# Altium schematic sheet AFE.SchDoc: Analog Front End
size A4; Date: 2016/01/04; Author: Samuel López; DocumentNumber: 2; SheetNumber: 2; SheetTotal: 7; Project: H2H Main Board
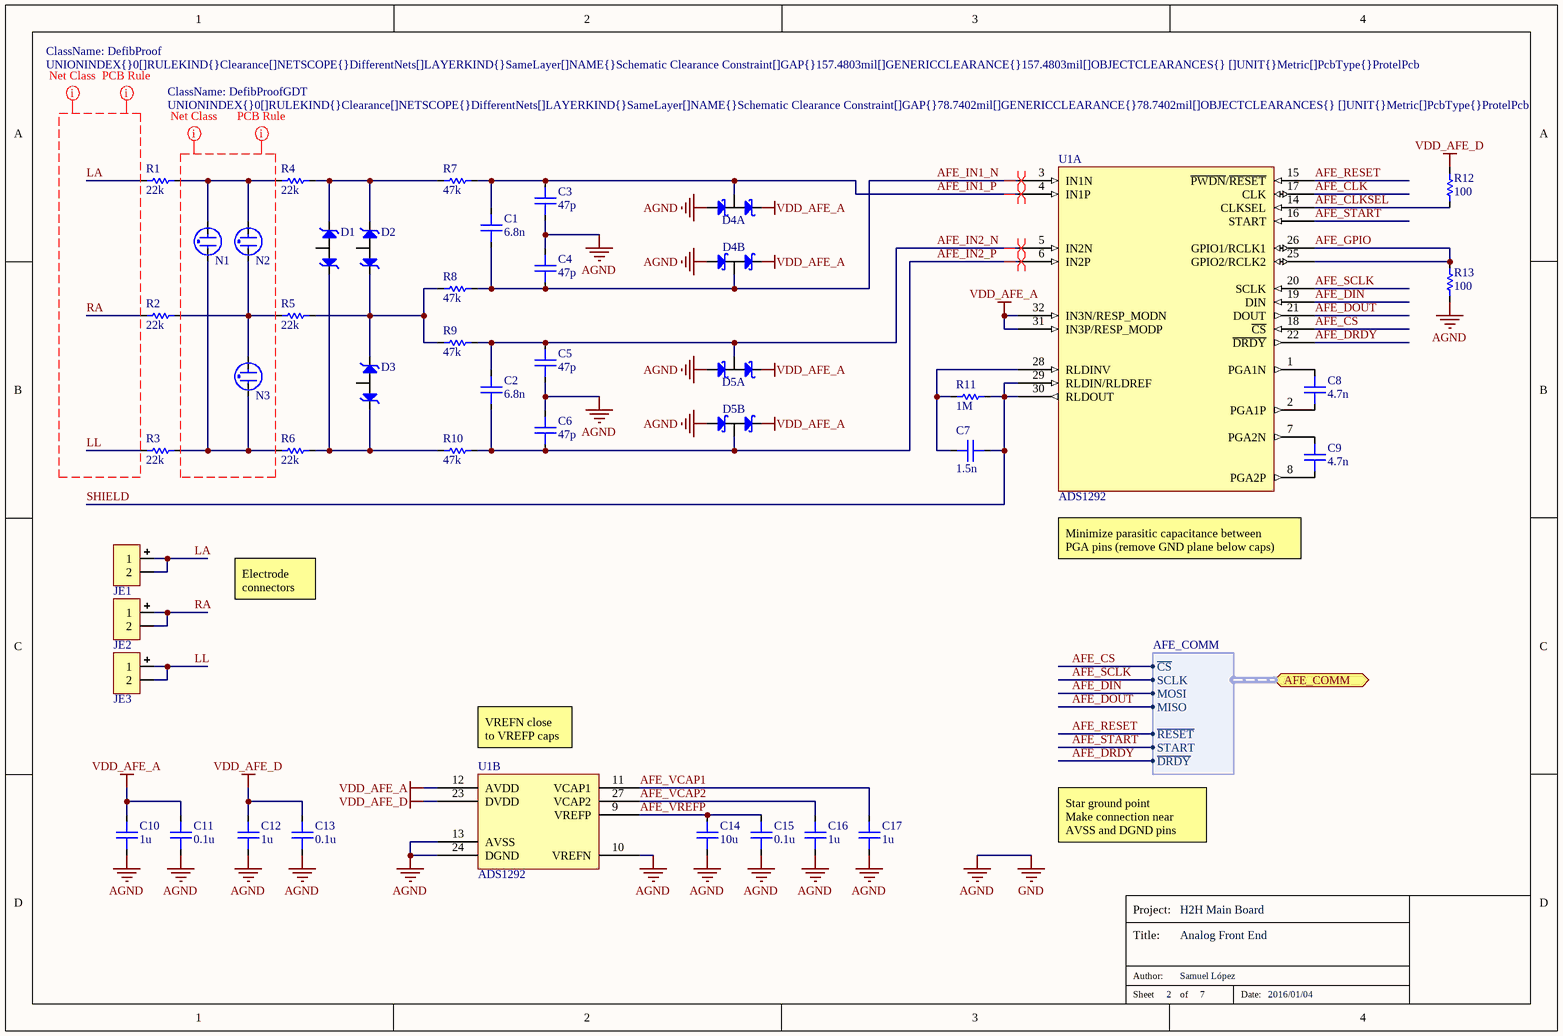
[diagram p0: AFE.SchDoc]

## Parts
C1  6.8n  [C0603]
C2  6.8n  [C0603]
C3  47p  [C0603]
C4  47p  [C0603]
C5  47p  [C0603]
C6  47p  [C0603]
C7  1.5n  [C0603]
C8  4.7n  [C0603]
C9  4.7n  [C0603]
C10  1u  [C0603]
C11  0.1u  [C0603]
C12  1u  [C0603]
C13  0.1u  [C0603]
C14  10u  [C0603]
C15  0.1u  [C0603]
C16  1u  [C0603]
C17  1u  [C0603]
D1  PESD5V0X1  [PESD5V0X1BT]  (value not drawn)
D2  PESD5V0X1  [PESD5V0X1BT]  (value not drawn)
D3  PESD5V0X1  [PESD5V0X1BT]  (value not drawn)
D4  BAS70DW-04  [BAS70DW-04]  (value not drawn)  (parts A,B of 2)
D5  BAS70DW-04  [BAS70DW-04]  (value not drawn)  (parts A,B of 2)
JE1  JST PH 2 Pin  [S2B-PH-K-S]  (value not drawn)
JE2  JST PH 2 Pin  [S2B-PH-K-S]  (value not drawn)
JE3  JST PH 2 Pin  [S2B-PH-K-S]  (value not drawn)
N1  GDT  [2051-09-SM]  (value not drawn)
N2  GDT  [2051-09-SM]  (value not drawn)
N3  GDT  [2051-09-SM]  (value not drawn)
R1  22k  [R2512]
R2  22k  [R2512]
R3  22k  [R2512]
R4  22k  [R2512]
R5  22k  [R2512]
R6  22k  [R2512]
R7  47k  [R0603]
R8  47k  [R0603]
R9  47k  [R0603]
R10  47k  [R0603]
R11  1M  [R0603]
R12  100  [R0603]
R13  100  [R0603]
U1  ADS1292  [ADS129x]  (parts A,B of 2)

## Ports
AFE_COMM (harness AFE_COMM)

## Harnesses
AFE_COMM: SCLK, MOSI, MISO, ~{CS}, ~{RESET}, START, ~{DRDY}

## Nets
AGND: C3.1 C4.2 C5.1 C6.2 C10.1 C11.1 C12.1 C13.1 C14.1 C15.1 C16.1 C17.1 D4.1(A1) D4.4(A2) D5.1(A1) D5.4(A2) R13.2 U1.10(VREFN) U1.13(AVSS) U1.24(DGND)  [also labelled GND]
VDD_AFE_A: C10.2 C11.2 D4.2(K1) D4.5(K2) D5.2(K1) D5.5(K2) U1.12(AVDD) U1.31(IN3P/RESP_MODP) U1.32(IN3N/RESP_MODN)
VDD_AFE_D: C12.2 C13.2 R12.1 U1.23(DVDD)
AFE_CLK: U1.17(CLK)
AFE_CLKSEL: R12.2 U1.14(CLKSEL)
AFE_CS: U1.18(~{CS}) ; port AFE_COMM.~{CS}
AFE_DIN: U1.19(DIN) ; port AFE_COMM.MOSI
AFE_DOUT: U1.21(DOUT) ; port AFE_COMM.MISO
AFE_DRDY: U1.22(~{DRDY}) ; port AFE_COMM.~{DRDY}
AFE_GPIO: R13.1 U1.25(GPIO2/RCLK2) U1.26(GPIO1/RCLK1)
AFE_IN1_N: C1.1 C4.1 D4.3(AK2) R8.2 U1.3(IN1N)
AFE_IN1_P: C1.2 C3.2 D4.6(AK1) R7.2 U1.4(IN1P)
AFE_IN2_N: C2.2 C5.2 D5.6(AK1) R9.2 U1.5(IN2N)
AFE_IN2_P: C2.1 C6.1 D5.3(AK2) R10.2 U1.6(IN2P)
AFE_RESET: U1.15(~{PWDN}/~{RESET}) ; port AFE_COMM.~{RESET}
AFE_SCLK: U1.20(SCLK) ; port AFE_COMM.SCLK
AFE_START: U1.16(START) ; port AFE_COMM.START
AFE_VCAP1: C17.2 U1.11(VCAP1)
AFE_VCAP2: C16.2 U1.27(VCAP2)
AFE_VREFP: C14.2 C15.2 U1.9(VREFP)
LA: JE1.1 JE1.2 R1.1
LL: JE3.1 JE3.2 R3.1
RA: JE2.1 JE2.2 R2.1
SHIELD: C7.1 R11.2 U1.29(RLDIN/RLDREF) U1.30(RLDOUT)
NetC7_2: C7.2 R11.1 U1.28(RLDINV)
NetC8_1: C8.1 U1.2(PGA1P)
NetC8_2: C8.2 U1.1(PGA1N)
NetC9_1: C9.1 U1.8(PGA2P)
NetC9_2: C9.2 U1.7(PGA2N)
NetD1_1: D1.1(K1) D3.1(K1) R6.2 R10.1
NetD1_2: D1.2(K2) D2.2(K2) R4.2 R7.1
NetD2_1: D2.1(K1) D3.2(K2) R5.2 R8.1 R9.1
NetN1_1: N1.1 N3.1 R3.2 R6.1
NetN1_2: N1.2 N2.2 R1.2 R4.1
NetN2_1: N2.1 N3.2 R2.2 R5.1

Not connected (* = marked no-connect by the designer): D1 3(A); D2 3(A); D3 3(A)

## Layout directives
differential pair: AFE_IN1_N, AFE_IN1_P, AFE_IN2_N, AFE_IN2_P
net class DefibProof: LA, LL, RA
rule Clearance Constraint [Clearance = 4mm]: LA, LL, RA
net class DefibProofGDT: (no net found under the mark)
rule Clearance Constraint [Clearance = 2mm]: (no net found under the mark)

## Notes on the sheet
- Minimize parasitic capacitance between
  PGA pins (remove GND plane below caps)
- Electrode
  connectors
- (near U1) VREFN close
  to VREFP caps
- Star ground point
  Make connection near AVSS and DGND pins
- Project:
- Title:
- Sheet
- Author:
- of
- Date:

## Library data of the parts
C1-C17 = Capacitor: Rated Voltage: *
  C1 C2: Value: 6.8n
  C3-C6: Value: 47p
  C7: Value: 1.5n
  C8 C9: Value: 4.7n
  C10 C12 C16 C17: Value: 1u
  C11 C13 C15: Value: 0.1u
  C14: Value: 10u
D1-D3 = PESD5V0X1: TVS - Bidirectional Zener Diode; Capacitance: 1 pF; Supplier 1: Digi-Key; Supplier Part Number 1: 568-4676-1-ND
D4 D5 = BAS70DW-04: TVS - Dual Schottky Rail-to-rail Protection; Supplier 1: Digi-Key; Supplier Part Number 1: BAS70DW-04FDICT-ND
JE1-JE3 = S2B-PH-K-S: Conn - Battery, Male, 2 Pin, PCB, Right Angle; Supplier 1: Digi-Key; Supplier Part Number 1: 455-1719-ND
N1-N3 = 2051-09-SM: TVS - Gas Discharge Tube; DC Sparkover: 90 V; Impulse Sparkover (1000V/us): <600 V; Glow Voltage: 70 V; Arc Voltage: 10 V; Glow-Arc Transition Current: <1 A; Impulse Sparkover (100V/us): <500 V; Supplier 1: Digi-Key; Supplier Part Number 1: 2051-09-SM-RPLFCT-ND
R1-R13 = Resistor: Power: *
  R1-R6: Value: 22k
  R7-R10: Value: 47k
  R11: Value: 1M
  R12 R13: Value: 100
U1 = ADS1292: IC - Analog Front End - Medical; Supplier 1: Digi-Key; Supplier Part Number 1: 296-30137-5-ND